# Altium schematic sheet Sheet4.SchDoc: Название платы
size 594 x 420 mm; ApprovedBy: Рогов; CheckedBy: Фамилия проверяющего; DrawnBy: Фамилия разработчика; DocumentNumber: Введите номер платы + Э3; SheetNumber: пусто если листов 1, иначе 1; SheetTotal: количество листов; Format: A2; DocumentType: тип схемы; Title1str: (вторая строка при необходимости); ImagePath: Введите номер платы
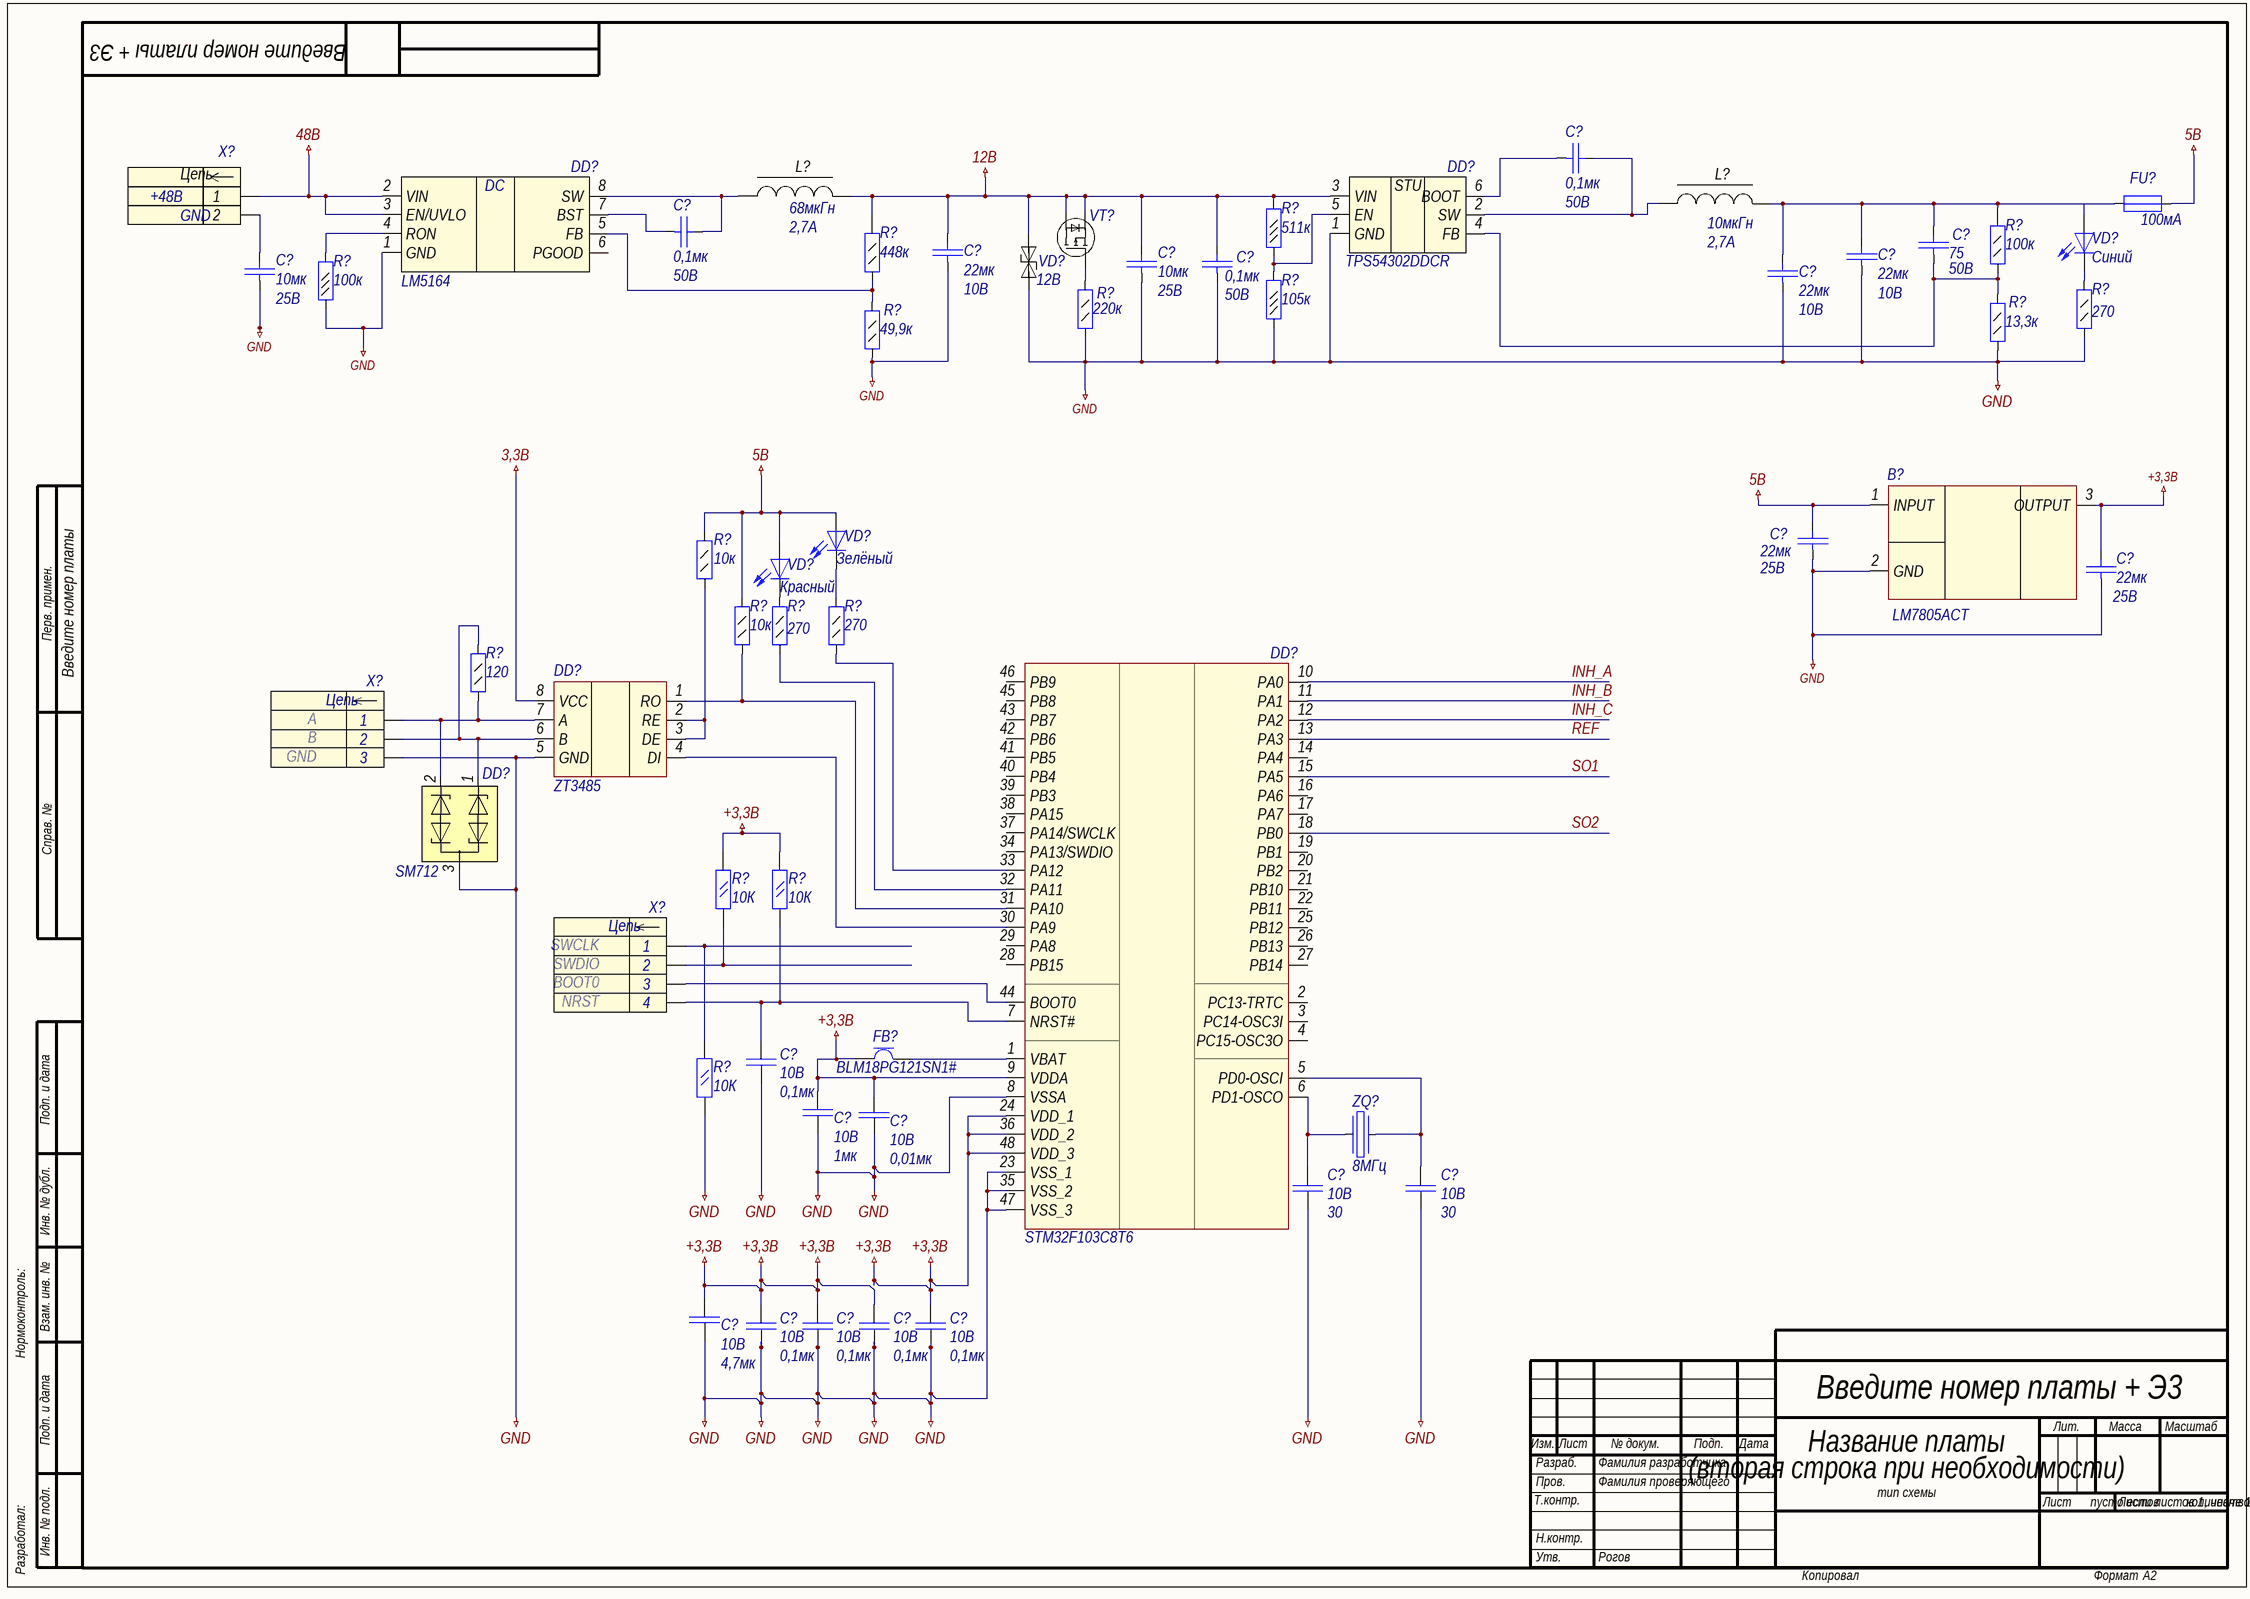
[diagram p0: Sheet4.SchDoc]

## Parts
(Parts that share a designator on the sheet are numbered #1, #2 ... from top to bottom, then left to right.)
B?  LM7805ACT  [TO254P470X1016X2019-3P]
C?#1  value 0,1мк  Voltage: 50B  [C0603]  (hidden comment: Capacitor)
C?#2  value 0,1мк  Voltage: 50B  [C0603]  (hidden comment: Capacitor)
C?#3  value 75  Voltage: 50B  [C0603]  (hidden comment: Capacitor)
C?#4  value 22мк  Voltage: 10B  [C0603]  (hidden comment: Capacitor)
C?#5  value 22мк  Voltage: 10B  [C0603]  (hidden comment: Capacitor)
C?#6  value 10мк  Voltage: 25В  [C1210]  (hidden comment: Capacitor)
C?#7  value 0,1мк  Voltage: 50B  [C0603]  (hidden comment: Capacitor)
C?#8  value 10мк  Voltage: 25В  [C1210]  (hidden comment: Capacitor)
C?#9  value 22мк  Voltage: 10B  [C0603]  (hidden comment: Capacitor)
C?#10  value 22мк  Voltage: 25В  [C1210]  (hidden comment: Capacitor)
C?#11  value 22мк  Voltage: 25В  [C1210]  (hidden comment: Capacitor)
C?#12  Voltage: 10В  Capacitance: 0,1мк  [CH0402C]  (hidden comment: Capacitor)
C?#13  Voltage: 10В  Capacitance: 1мк  [CH0201C]  (hidden comment: Capacitor)
C?#14  Voltage: 10В  Capacitance: 0,01мк  [CH0402C]  (hidden comment: Capacitor)
C?#15  Voltage: 10В  Capacitance: 30  [CH0201C]  (hidden comment: Capacitor)
C?#16  Voltage: 10В  Capacitance: 30  [CH0201C]  (hidden comment: Capacitor)
C?#17  Voltage: 10В  Capacitance: 4,7мк  [CH0402C]  (hidden comment: Capacitor)
C?#18  Voltage: 10В  Capacitance: 0,1мк  [CH0402C]  (hidden comment: Capacitor)
C?#19  Voltage: 10В  Capacitance: 0,1мк  [CH0402C]  (hidden comment: Capacitor)
C?#20  Voltage: 10В  Capacitance: 0,1мк  [CH0402C]  (hidden comment: Capacitor)
C?#21  Voltage: 10В  Capacitance: 0,1мк  [CH0402C]  (hidden comment: Capacitor)
DD?#1  LM5164
DD?#2  Synchronous  [SOT95P280X110-6L]  (value not drawn)
DD?#3  STM32F103C8T6  [STM32F103 48pins]
DD?#4  ZT3485  [ZT3485E]
DD?#5  SM712  [SOT23-3]
FB?  Model: BLM18PG121SN1#  [CH0603L]  (hidden comment: Ferrite bead)
FU?  Fuse  [FUSE812]  (value not drawn)
L?#1  IND  [WE-MAIA_4030]  (value not drawn)
L?#2  IND  [WE-MAIA_4030]  (value not drawn)
R?#1  value 511к  [R0402]  (hidden comment: Resistor_0,062Вт)
R?#2  value 100к  [R0805]  (hidden comment: Resistor_0,125Вт)
R?#3  value 448к  [R0805]  (hidden comment: Resistor_0,125Вт)
R?#4  value 100к  [R0402]  (hidden comment: Resistor_0,062Вт)
R?#5  value 105к  [R0402]  (hidden comment: Resistor_0,062Вт)
R?#6  value 220к  [R0805]  (hidden comment: Resistor_0,125Вт)
R?#7  value 270  [R0805]  (hidden comment: Resistor_0,125Вт)
R?#8  value 13,3к  [R0805]  (hidden comment: Resistor_0,125Вт)
R?#9  value 49,9к  [R0805]  (hidden comment: Resistor_0,125Вт)
R?#10  Resistor_0,125Вт  [R0805]  (value not drawn)
R?#11  value 10к  [R0805]  (hidden comment: Resistor_0,125Вт)
R?#12  value 270  [R0805]  (hidden comment: Resistor_0,125Вт)
R?#13  value 270  [R0805]  (hidden comment: Resistor_0,125Вт)
R?#14  value 120  [R0805]  (hidden comment: Resistor_0,125Вт)
R?#15  Impedance: 10К  [CH0402R]  (hidden comment: Res_0.125)
R?#16  Impedance: 10К  [CH0402R]  (hidden comment: Res_0.125)
R?#17  Impedance: 10К  [CH0402R]  (hidden comment: Res_0.125)
VD?#1  LED  [L_0805]  (value not drawn)
VD?#2  (no value)  [SMA_stm_tvs_bidir]
VD?#3  LED  [L_0805]  (value not drawn)
VD?#4  LED  [L_0805]  (value not drawn)
VT?  CSD25202W15  [BGA9C50P3X3_146X146X62]  (value not drawn)
X?#1  connector  [CON: 163-179PH-EX]  (value not drawn)
X?#2  2: B  3: GND  1: A  [CON: PBS-3]  (hidden comment: 3_pins)
X?#3  2: SWDIO  3: BOOT0  1: SWCLK  4: NRST  [CON: CWF-4R]  (hidden comment: 4_pins)
ZQ?  Freq: 8МГц  [OSC: 5032]  (hidden comment: Oscillator)

## Nets
3,3В: DD?#4.8(VCC)
5В: B?.1(INPUT) C?#10.2 FU?.2 R?#10.2 R?#11.2 VD?#3.2(A) VD?#4.2(A)
12В: C?#4.2 C?#6.2 C?#7.2 DD?#2.3(VIN) L?#1.2 R?#1.2 R?#3.2 VD?#2.2(Catod) VT?.D(Drain) VT?.S(Source)
48В: DD?#1.2(VIN) DD?#1.3(EN/UVLO) X?#1.1
+3,3В: B?.3(OUTPUT) C?#11.2 C?#13.2(C1-) C?#14.1(С+) C?#17.2(C1-) C?#18.1(C1+) C?#19.1(C1+) C?#20.1(C1+) C?#21.1(C1+) DD?#3.9(VDDA) DD?#3.24(VDD_1) DD?#3.36(VDD_2) DD?#3.48(VDD_3) FB?.1 R?#15.1(C1-) R?#16.1(C1-)
GND: B?.2(GND) C?#4.1 C?#5.1 C?#6.1 C?#7.1 C?#8.1 C?#9.1 C?#10.1 C?#11.1 C?#12.2(C1-) C?#13.1(C1+) C?#14.2(С-) C?#15.2(C1-) C?#16.2(C1-) C?#17.1(C1+) C?#18.2(C1-) C?#19.2(C1-) C?#20.2(C1-) C?#21.2(C1-) DD?#1.1(GND) DD?#2.1(GND) DD?#3.8(VSSA) DD?#3.23(VSS_1) DD?#3.35(VSS_2) DD?#3.47(VSS_3) DD?#4.5(GND) DD?#5.3 R?#4.1 R?#5.1 R?#6.1 R?#7.1 R?#8.1 R?#9.1 R?#17.2(C1-) VD?#2.1(Catod) X?#2.3
INH_A: DD?#3.10(PA0)
INH_B: DD?#3.11(PA1)
INH_C: DD?#3.12(PA2)
REF: DD?#3.13(PA3)
SO1: DD?#3.15(PA5)
SO2: DD?#3.18(PB0)
NetC?#1_1: C?#1.1 DD?#2.6(BOOT)
NetC?#1_2: C?#1.2 DD?#2.2(SW) L?#2.1
NetC?#2_1: C?#2.1 DD?#1.7(BST)
NetC?#2_2: C?#2.2 DD?#1.8(SW) L?#1.1
NetC?#3_1: C?#3.1 DD?#2.4(FB) R?#2.1 R?#8.2
NetC?#3_2: C?#3.2 C?#5.2 C?#9.2 FU?.1 L?#2.2 R?#2.2 VD?#1.2(A)
NetC?#8_2: C?#8.2 X?#1.2
NetC?#12_1: C?#12.1(C1+) DD?#3.7(NRST#) R?#16.2(C1-) X?#3.4
NetC?#15_1: C?#15.1(C1+) DD?#3.6(PD1-OSCO) ZQ?.1
NetC?#16_1: C?#16.1(C1+) DD?#3.5(PD0-OSCI) ZQ?.3
NetDD?#1_4: DD?#1.4(RON) R?#4.2
NetDD?#1_5: DD?#1.5(FB) R?#3.1 R?#9.2
NetDD?#2_5: DD?#2.5(EN) R?#1.1 R?#5.2
NetDD?#3_1: DD?#3.1(VBAT) FB?.2
NetDD?#3_30: DD?#3.30(PA9) DD?#4.4(DI)
NetDD?#3_31: DD?#3.31(PA10) DD?#4.1(RO) R?#11.1
NetDD?#3_32: DD?#3.32(PA11) R?#12.1
NetDD?#3_33: DD?#3.33(PA12) R?#13.1
NetDD?#3_44: DD?#3.44(BOOT0) X?#3.3
NetDD?#4_2: DD?#4.2(RE) DD?#4.3(DE) R?#10.1
NetDD?#4_6: DD?#4.6(B) DD?#5.1 R?#14.2 X?#2.2
NetDD?#4_7: DD?#4.7(A) DD?#5.2 R?#14.1 X?#2.1
NetR?#6_2: R?#6.2 VT?.D(Gate)
NetR?#7_2: R?#7.2 VD?#1.1(K)
NetR?#12_2: R?#12.2 VD?#4.1(K)
NetR?#13_2: R?#13.2 VD?#3.1(K)
NetR?#15_2: R?#15.2(C1-) X?#3.2
NetR?#17_1: R?#17.1(C1-) X?#3.1

Not connected (* = marked no-connect by the designer): DD?#1 6(PGOOD); DD?#3 2(PC13-TRTC) 3(PC14-OSC3I) 4(PC15-OSC3O) 14(PA4) 16(PA6) 17(PA7) 19(PB1) 20(PB2) 21(PB10) 22(PB11) 25(PB12) 26(PB13) 27(PB14) 28(PB15) 29(PA8) 34(PA13/SWDIO) 37(PA14/SWCLK) 38(PA15) 39(PB3) 40(PB4) 41(PB5) 42(PB6) 43(PB7) 45(PB8) 46(PB9)

## Notes on the sheet
- +48B
- (near L?#1) 68мкГн
- (near L?#1) 2,7А
- (near L?#2) 10мкГн
- 2,7А
- (near VD?#1) Синий
- (near FU?) 100мА
- (near VD?#2) 12В
- (near DD?#2) TPS54302DDCR
- Перв. примен.
- (near R?#10) 10к
- (near VD?#4) Красный
- (near VD?#3) Зелёный
- Справ. №
- Подп. и дата
- Инв. № дубл.
- Нормоконтроль:
- Взам. инв. №
- Изм.
- Лист
- № докум.
- Подп.
- Дата
- Лит.
- Масса
- Масштаб
- Т.контр.
- Пров.
- Разраб.
- Листов
- Разработал:
- Инв. № подл.
- Н.контр.
- Утв.
- Копировал
- Формат
- (in symbol 3_pins) Цепь
- (in symbol 4_pins) Цепь
- (in symbol CONN_02P) Цепь; GND
- (in symbol LM5164) DC
- (in symbol TPS54302DDCR) STU

## Library data of the parts
B? = LM7805ACT: ON Semiconductor LM7805ACT Linear Voltage Regulator, 1A, 5 V 3-Pin, TO-220; Geometry.Height: 4.7mm; Manufacturer_Name: ON Semiconductor; Manufacturer_Part_Number: LM7805ACT; RS Part Number: 8062839; RS Price/Stock: http://uk.rs-online.com/web/p/products/8062839; Mouser Part Number: 8062839; Mouser Price/Stock: http://uk.rs-online.com/web/p/products/8062839; Datasheet Link: https://componentsearchengine.com/Datasheets/2/LM7805ACT.pdf
C?#1-C?#5 C?#7 C?#9 = cap131: Конденсатор; Part Name: Capacitors; Part Number: GRM188R71H104K; id: cap131; TKE: X7R
C?#6 C?#8 = cap194: Конденсатор; Part Name: Capacitors; Part Number: GRM32ER61A106K; id: cap194; TKE: X7R
C?#10 C?#11 = cap194: Конденсатор; Part Name: Capacitors; Manufacture: Murata; Part Number: GRM32ER61A106K; id: cap194; TKE: X7R
C?#12 C?#18-C?#21 = Capacitor: Manufacture: AVX; Model: 0402ZD103KAT2A; Case: 0402; HelpURL: https://ru.mouser.com/ProductDetail/AVX/0402ZD103KAT2A?qs=sGAEpiMZZMs0AnBnWHyRQKdiqyDPVQdAu74W%2fwwRq8A%3d
C?#13 = Capacitor: Manufacture: Murata Electronics; Model: GRM033C81A105ME05E; Case: 0201; HelpURL: https://ru.mouser.com/ProductDetail/Murata-Electronics/GRM033C81A105ME05E?qs=sGAEpiMZZMs0AnBnWHyRQN7%2fAA2D2lPPXfhIkJ3ChWM%252bNp28BKy3Ug%3d%3d
C?#14 = Capacitor: Manufacture: Yageo; Model: CC0402MRX7R6BB103; Case: 0402; HelpURL: https://ru.mouser.com/ProductDetail/Yageo/CC0402MRX7R6BB103?qs=sGAEpiMZZMs0AnBnWHyRQCF1lTWZ1EBLC11KxQK9NtY%3D
C?#15 C?#16 = Capacitor: Manufacture: KEMET; Model: CBR02C308B8GAC; Case: 0201; HelpURL: https://ru.mouser.com/ProductDetail/KEMET/CBR02C308B8GAC?qs=sGAEpiMZZMs0AnBnWHyRQKJCfzG%2fi9wHnix1yOwfSPhOUzhoHh%252bTpQ%3d%3d
C?#17 = Capacitor: Manufacture: Murata Electronics; Model: ZRB15XR61A475KE01D; Case: 0402; HelpURL: https://ru.mouser.com/ProductDetail/Murata-Electronics/ZRB15XR61A475KE01D?qs=sGAEpiMZZMs0AnBnWHyRQO9VYadaKTO%252beZnE9zFUsbv4FmCibz4ZfQ%3d%3d
DD?#2 = TPS54302DDCR: Synchronous / Step-Down / Converter; Manufacturer: Texas Instruments; Type1: Преобразователь напряжения; PartNumber: TPS54302DDCR; Package: SOT-23; Family: Схемы интегральные
DD?#3 = STM32: Manufacture: STMicroelectronics; Case: LQFP48; Model: STM32F103C8T6; HelpURL: https://www.st.com/en/microcontrollers-microprocessors/stm32f103c8.html
DD?#5 = diode7: TVS; Part Name: TVS diode RS-485; Part Number: SM712.TCT; Manufacture: Semtech; id: diode7; Breakdown Voltage: 13,3B; Leakage current: 1mA; Quantity of diod's: 2
FB? = Ferrite bead: Manufacture: murata; Max current: 2A; Impedance: 120; Case: 0603; HelpURL: https://www.murata.com/en-us/products/productdetail?partno=BLM18PG121SN1%23; Inductance: *
FU? = fuse0: Предохранитель; Part Name: Resettable Fuses; Manufacture: Bourns; Part Number: MF-MSMF075; id: fuse0; V max: 13,2B; I max: 100A; I hold: 0,75A; I trip: 1,5A; Resistance: 0,45Ohms
L?#1 L?#2 = IND: Manufacturer: Wurth Electronics; PartNumber: 78438357100; Inductance: 10 мкГн; Current: 2,7А; Type1: Дроссель; Package: 4030; Family: Дроссели
R?#1 R?#4 R?#5 = res676: Резистор; id: res676; Accuracy: 5%; Part Name: Resistor; Power: 0,062Вт
R?#2 R?#3 = res121: Резистор; id: res121; Accuracy: 1%; Part Name: Resistor; Power: 0,125Вт
R?#6 = res129: Резистор; id: res129; Accuracy: 1%; Part Name: Resistor; Power: 0,125Вт
R?#7 R?#12 R?#13 = res59: Резистор; id: res59; Accuracy: 1%; Part Name: Resistor; Power: 0,125Вт
R?#8 R?#9 = res100: Резистор; id: res100; Accuracy: 1%; Part Name: Resistor; Power: 0,125Вт
R?#10 R?#11 = res97: Резистор; id: res97; Accuracy: 1%; Part Name: Resistor; Power: 0,125Вт
R?#14 = res51: Резистор; id: res51; Accuracy: 1%; Part Name: Resistor; Power: 0,125Вт
R?#15-R?#17 = Res_0.125: Manufacture: Yageo; Model: AC0402FR-7W10KL; Case: 0402; HelpURL: https://ru.mouser.com/ProductDetail/Yageo/AC0402FR-7W10KL?qs=sGAEpiMZZMvdGkrng054txbN%2f5LBcxld3gyqgmBuiXRPLjwmdNqO3A%3d%3d
VD?#1 VD?#3 VD?#4 = diode8: Светодиод; Part Number: KP-2012EC; id: diode8; Part Name: LED
VD?#2 = VD_TVS_Bidirectional: PartNumber: SMAJ12A/CA; Manufacturer: ST Microelectronics; Type1: Стабилитрон; Family: Приборы полупроводниковые; Package: SMA(DO-214AC)
VT? = Mosfet_P: Manufacturer: Texas Instruments; Type1: Транзистор полевой; Family: Приборы полупроводниковые; Package: DSBGA; PartNumber: CSD25202W15
X?#1 = CONN_02P: 2 pin; Manufacturer: *
X?#2 = 3_pins: Manufacture: Omron Electronics; Model: XN2D-1371; HelpURL: https://ru.mouser.com/ProductDetail/Omron-Electronics/XN2D-1371?qs=sGAEpiMZZMvd2mIcYG7oaC0TeQEBnk0J8ExArlTDElw%3D; Case: *
X?#3 = 4_pins: Manufacture: Omron Electronics; Model: XN2D-4471; HelpURL: https://ru.mouser.com/ProductDetail/Omron-Electronics/XN2D-4471?qs=sGAEpiMZZMvd2mIcYG7oaC0TeQEBnk0JvHtcE4UuDS0%3D; Case: *
ZQ? = Oscillator: Manufacture: CTS Electronic Components; Model: 636L3C008M00000; HelpURL: https://ru.mouser.com/ProductDetail/CTS-Electronic-Components/636L3C008M00000?qs=sGAEpiMZZMt8zWNA7msRCjl4WCD9T6KEFNudNQm%252BeAU%3D; Case: 5x3,2mm
DD?#1 = LM5164: Model: LM5164